# EAGLE schematic uart-back1 (EAGLE 7.6.0)
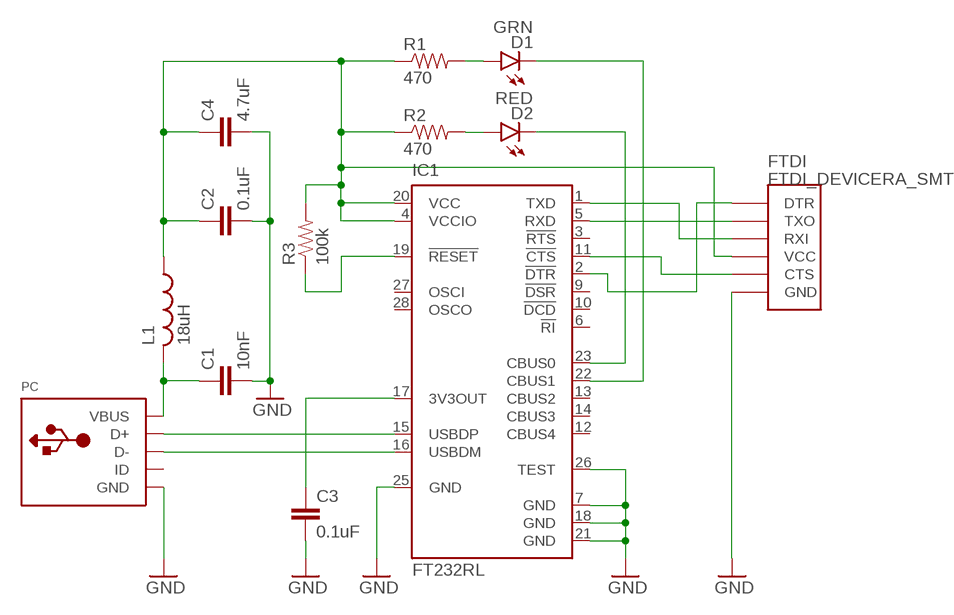
[diagram p0: schematic, sheet 1]

## Parts
C1  10nF  10NF/10000PF-50V-10%(0603)  [0603-CAP]
C2  0.1uF  0.1UF-25V-5%(0603)  [0603-CAP]
C3  0.1uF  0.1UF-25V-5%(0603)  [0603-CAP]
C4  4.7uF  4.7UF-6.3V-10%(0603)0603  [0603-CAP]
D1  GRN  LED-GREEN0603  [LED-0603]
D2  RED  LED-RED0603  [LED-0603]
FTDI  FTDI_DEVICERA_SMT  [FTDI_DEVICE_RA_SMT]
IC1  FT232RL  [SSOP28]
L1  18uH  L-USWE-TPC  [POWER-CHOKE_WE-TPC]
PC  USBMINIB  [USB-MINIB]
R1  470  470OHM1/10W1%(0603)  [0603-RES]
R2  470  470OHM1/10W1%(0603)  [0603-RES]
R3  100k  100KOHM-1/10W-1%(0603)  [0603-RES]

## Nets
GND: C1.2 C2.2 C3.2 C4.2 FTDI.6(GND) IC1.7(GND) IC1.18(GND) IC1.21(GND) IC1.25(GND) IC1.26(TEST) PC.GND
N$1: IC1.15(USBDP) PC.D+
N$2: IC1.16(USBDM) PC.D-
N$3: C3.1 IC1.17(3V3OUT)
N$4: FTDI.5(CTS) IC1.11(!CTS)
N$5: FTDI.1(DTR) IC1.2(!DTR)
N$6: IC1.19(!RESET) R3.1
N$7: C2.1 C4.1 FTDI.4(VCC) IC1.4(VCCIO) IC1.20(VCC) L1.1 R1.1 R2.1 R3.2
N$10: D2.C IC1.23(CBUS0)
N$11: D2.A R2.2
N$12: D1.A R1.2
N$13: D1.C IC1.22(CBUS1)
N$14: C1.1 L1.2 PC.VBUS
N$16: FTDI.3(RXI) IC1.1(TXD)
N$17: FTDI.2(TXO) IC1.5(RXD)
Unconnected: IC1.3(!RTS) IC1.6(!RI) IC1.9(!DSR) IC1.10(!DCD) IC1.12(CBUS4) IC1.13(CBUS2) IC1.14(CBUS3) IC1.27(OSCI) IC1.28(OSCO) PC.ID

## Library data of the parts
C1 = SparkFun-Capacitors:10NF/10000PF-50V-10%(0603): CAP-00867; MPN: C0603C103J1RACTU; OC_NEWARK: 76Y2901; PROD_ID: CAP-00867
C2 C3 = SparkFun-Capacitors:0.1UF-25V-5%(0603): CAP-08604; MPN: C0603C104K4RAC7081; OC_NEWARK: 76Y2903; PROD_ID: CAP-08604
C4 = SparkFun-Capacitors:4.7UF-6.3V-10%(0603): CAP-08280; MPN: 0603F475Z100CT; OC_NEWARK: 78Y5262; PROD_ID: CAP-08280
D1 = SparkFun-LED:LED-GREEN: Various green LEDs Green LEDs used in SFE Production 0603- DIO-00821 LARGE- DIO-00862 LILYPAD- DIO-09910; MPN: HSME-C191; OC_NEWARK: 05M0345; PROD_ID: DIO-00821; VALUE: GREEN
D2 = SparkFun-LED:LED-RED: Assorted Red LEDs LilyPad 1206- DIO-09912 1206- DIO-00809 0603- DIO-00819 "SMART" means more efficient and expensive; MPN: HSMC-C120; OC_NEWARK: 97K1631; PROD_ID: DIO-00819
FTDI = SparkFun-Connectors:FTDI_DEVICE: Connector which mates to FTDI basic or FTDI cable.; OC_NEWARK: unknown; PROD_ID: CONN-08971
IC1 = ftdichip:FT232R: Source: http://www.ftdichip.com/Documents/DataSheets/DS_FT232R_v104.pdf; MPN: FT232RL-REEL; OC_FARNELL: 1146032; OC_NEWARK: 91K9918
L1 = rcl:L-US: INDUCTOR, American symbol; MPN: 744052180; OC_NEWARK: 44W4543
PC = adafruit:USB: USB Connectors USBMINIB - Surface Mount Female Mini-B USB Connector 4UConnector: 06564 By microbuilder.eu Thru-hole RA Female Mini-B USB Connector 4UConnector: 18732 By ladyada.net; MPN: MUSB-B5-S-RA-TSMT-CS1; OC_NEWARK: 71Y7363
R1 R2 = SparkFun-Resistors:470OHM1/10W1%(0603): RES-07869; MPN: ERJ-P03F4700V; OC_NEWARK: 05X8640; PROD_ID: RES-07869
R3 = SparkFun-Resistors:100KOHM-1/10W-1%(0603): RES-07828; MPN: ERA-3AEB104V; OC_NEWARK: 08N2096; PROD_ID: RES-07828

## Net classes
0 default: width 0.305 mm, drill 0.508 mm, clearance 0.254 mm